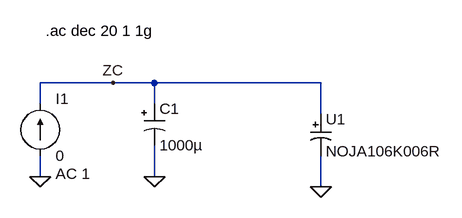
[diagram p0: schematic AVX_Niobium_test_d.asc]
AVX_Niobium_test_d.asc, the LTspice schematic file:
Version 4
SHEET 1 880 680
WIRE -272 160 -384 160
WIRE -208 160 -272 160
WIRE 48 160 -208 160
WIRE -384 192 -384 160
WIRE -208 192 -208 160
WIRE 48 208 48 160
WIRE -384 304 -384 272
WIRE -208 304 -208 256
WIRE 48 320 48 272
FLAG -384 304 0
FLAG -208 304 0
FLAG -272 160 ZC
FLAG 48 320 0
SYMBOL current -384 272 M180
WINDOW 0 24 88 Left 0
WINDOW 3 24 0 Left 0
WINDOW 123 24 -28 Left 0
WINDOW 39 0 0 Left 0
SYMATTR InstName I1
SYMATTR Value 0
SYMATTR Value2 AC 1
SYMBOL avx_niobium_d 32 208 R0
SYMATTR InstName U1
SYMBOL polcap -224 192 R0
WINDOW 3 24 64 Left 0
SYMATTR InstName C1
SYMATTR Value 1000µ
SYMATTR Description Capacitor
SYMATTR Type cap
SYMATTR SpiceLine V=4 Irms=6.7 Rser=0.006 Lser=0 mfg="KEMET" pn="T530X108M004ASE006" type="Tantalum"
TEXT -376 80 Left 0 !.ac dec 20 1 1g

The netlist it stands for:
* AVX_Niobium_test_d.asc
I1 0 ZC 0 AC 1
XU1 ZC 0 NOJA106K006R NOJA106K006R  ; pins A B
C1 ZC 0 1000µ V=4 Irms=6.7 Rser=0.006 Lser=0 mfg="KEMET" pn="T530X108M004ASE006" type="Tantalum"
.ac dec 20 1 1g
.lib AVX_NIOBIUMOXIDE.lib
.backanno
.end